# EAGLE design LCD2004_Adapter (EAGLE 9.6.2)
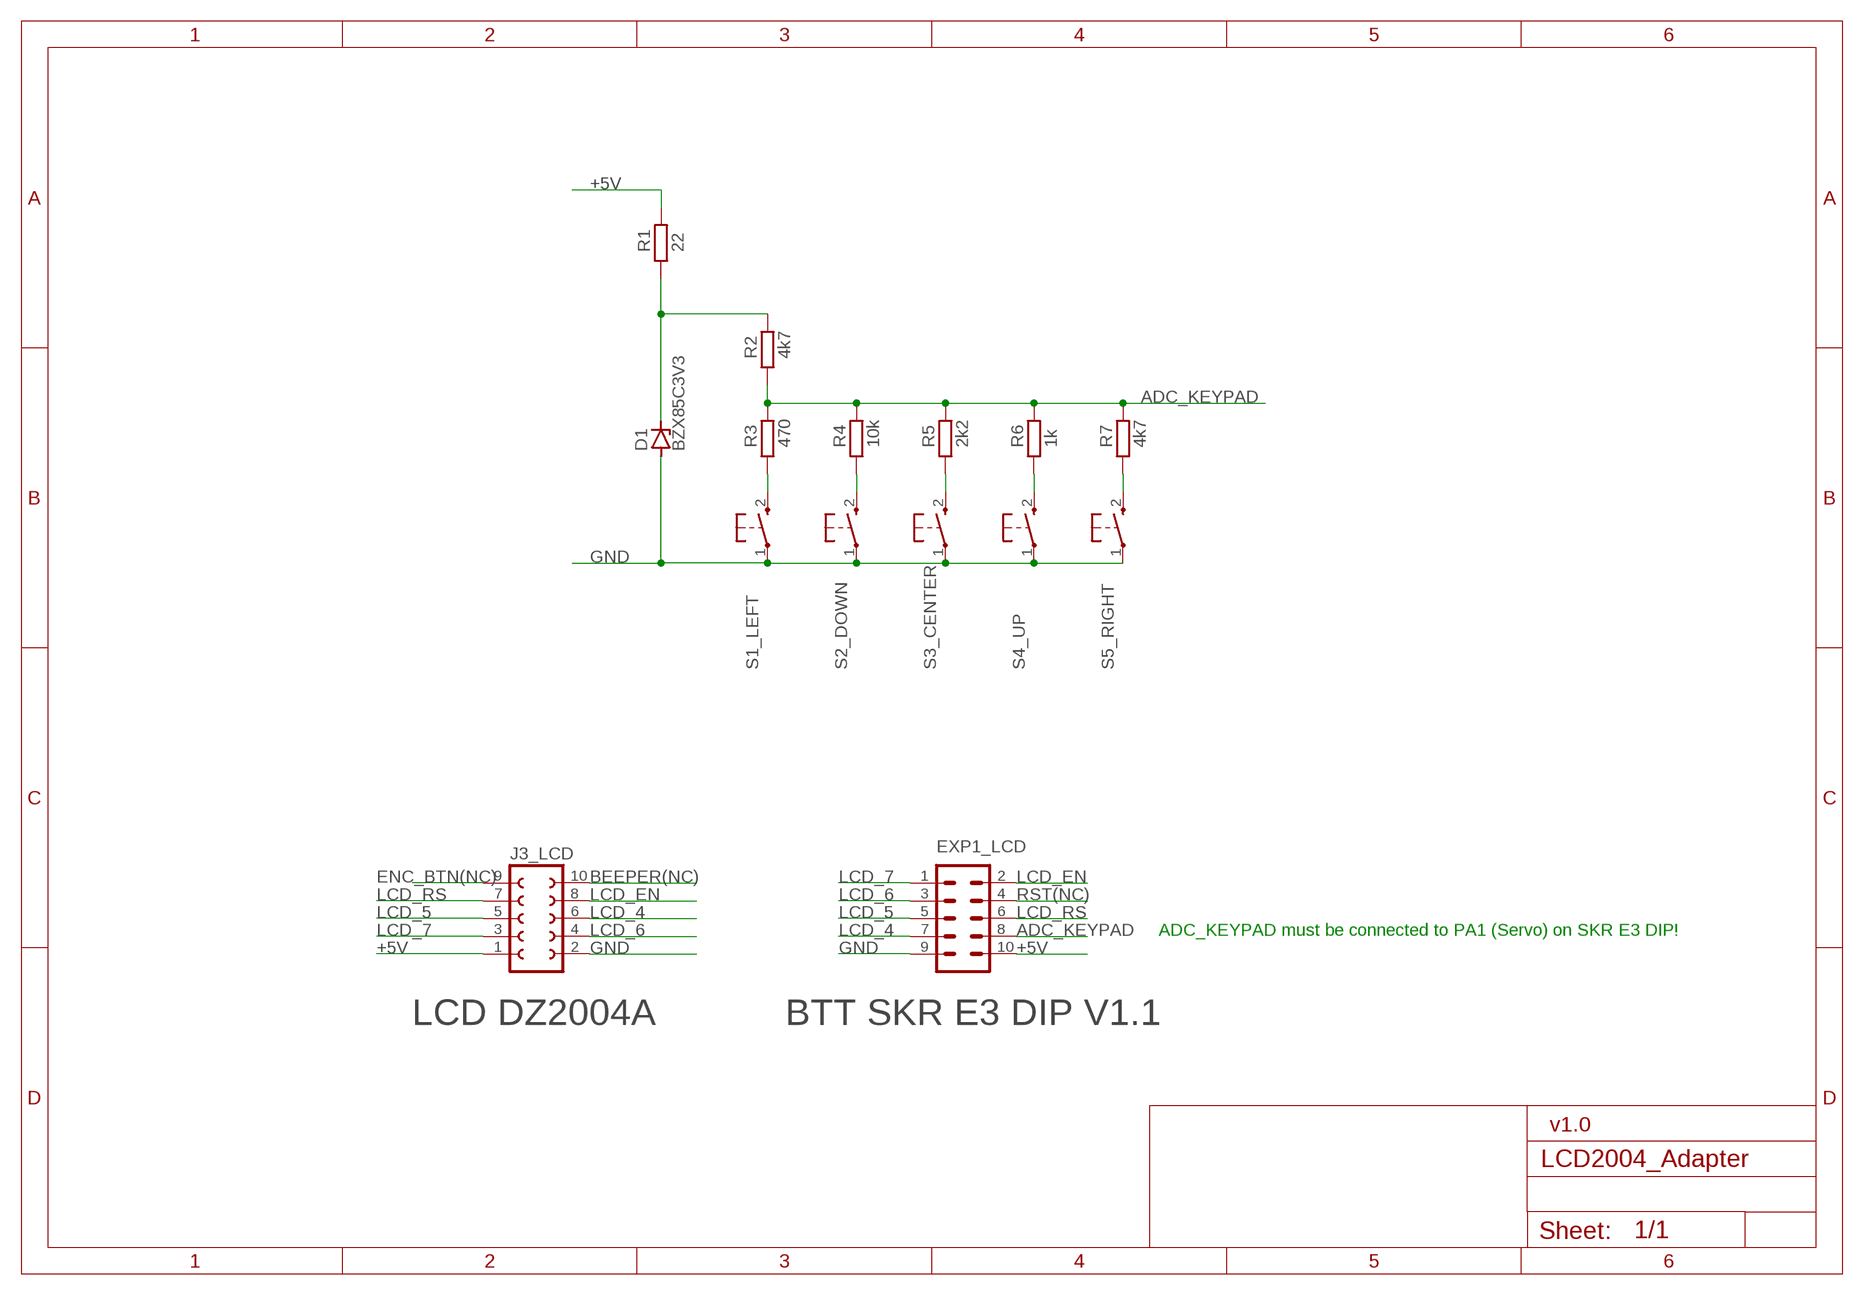
[diagram p0: schematic, sheet 1]

## Parts
D1  BZX85C3V3  BZX85  [DO41Z10]
EXP1_LCD  ML10  [ML10]
J3_LCD  FE05-2  [FE05-2]
R1  22  R-EU_0207/10  [0207/10]
R2  4k7  R-EU_0207/10  [0207/10]
R3  470  R-EU_0207/10  [0207/10]
R4  10k  R-EU_0207/10  [0207/10]
R5  2k2  R-EU_0207/10  [0207/10]
R6  1k  R-EU_0207/10  [0207/10]
R7  4k7  R-EU_0207/10  [0207/10]
S1_LEFT  KURZHUBTASTER  [B3F-10XX]
S2_DOWN  KURZHUBTASTER  [B3F-10XX]
S3_CENTER  KURZHUBTASTER  [B3F-10XX]
S4_UP  KURZHUBTASTER  [B3F-10XX]
S5_RIGHT  KURZHUBTASTER  [B3F-10XX]

## Nets
+5V: EXP1_LCD.10 J3_LCD.1 R1.2
ADC_KEYPAD: EXP1_LCD.8 R2.1 R3.2 R4.2 R5.2 R6.2 R7.2
BEEPER(NC): J3_LCD.10
ENC_BTN(NC): J3_LCD.9
GND: D1.A EXP1_LCD.9 J3_LCD.2 S1_LEFT.1(P) S2_DOWN.1(P) S3_CENTER.1(P) S4_UP.1(P) S5_RIGHT.1(P)
LCD_4: EXP1_LCD.7 J3_LCD.6
LCD_5: EXP1_LCD.5 J3_LCD.5
LCD_6: EXP1_LCD.3 J3_LCD.4
LCD_7: EXP1_LCD.1 J3_LCD.3
LCD_EN: EXP1_LCD.2 J3_LCD.8
LCD_RS: EXP1_LCD.6 J3_LCD.7
N$1: D1.C R1.1 R2.2
N$3: R3.1 S1_LEFT.2(S)
N$4: R4.1 S2_DOWN.2(S)
N$5: R5.1 S3_CENTER.2(S)
N$6: R6.1 S4_UP.2(S)
N$7: R7.1 S5_RIGHT.2(S)
RST(NC): EXP1_LCD.4

## Notes on the sheet
- ADC_KEYPAD must be connected to PA1 (Servo) on SKR E3 DIP!
- LCD DZ2004A | BTT SKR E3 DIP V1.1
- v1.0

## Library data of the parts
D1 = diode:BZX85: Z DIODE
EXP1_LCD = con-harting-ml:ML10: HARTING; OC_FARNELL: unknown; OC_NEWARK: unknown
J3_LCD = con-lsta:FE05-2: FEMALE HEADER; OC_FARNELL: unknown; OC_NEWARK: unknown
R1-R7 = rcl:R-EU_: RESISTOR, European symbol; SPICEPREFIX: R
S1_LEFT S2_DOWN S3_CENTER S4_UP S5_RIGHT = OwnDevices:KURZHUBTASTER: OMRON SWITCH

## Board
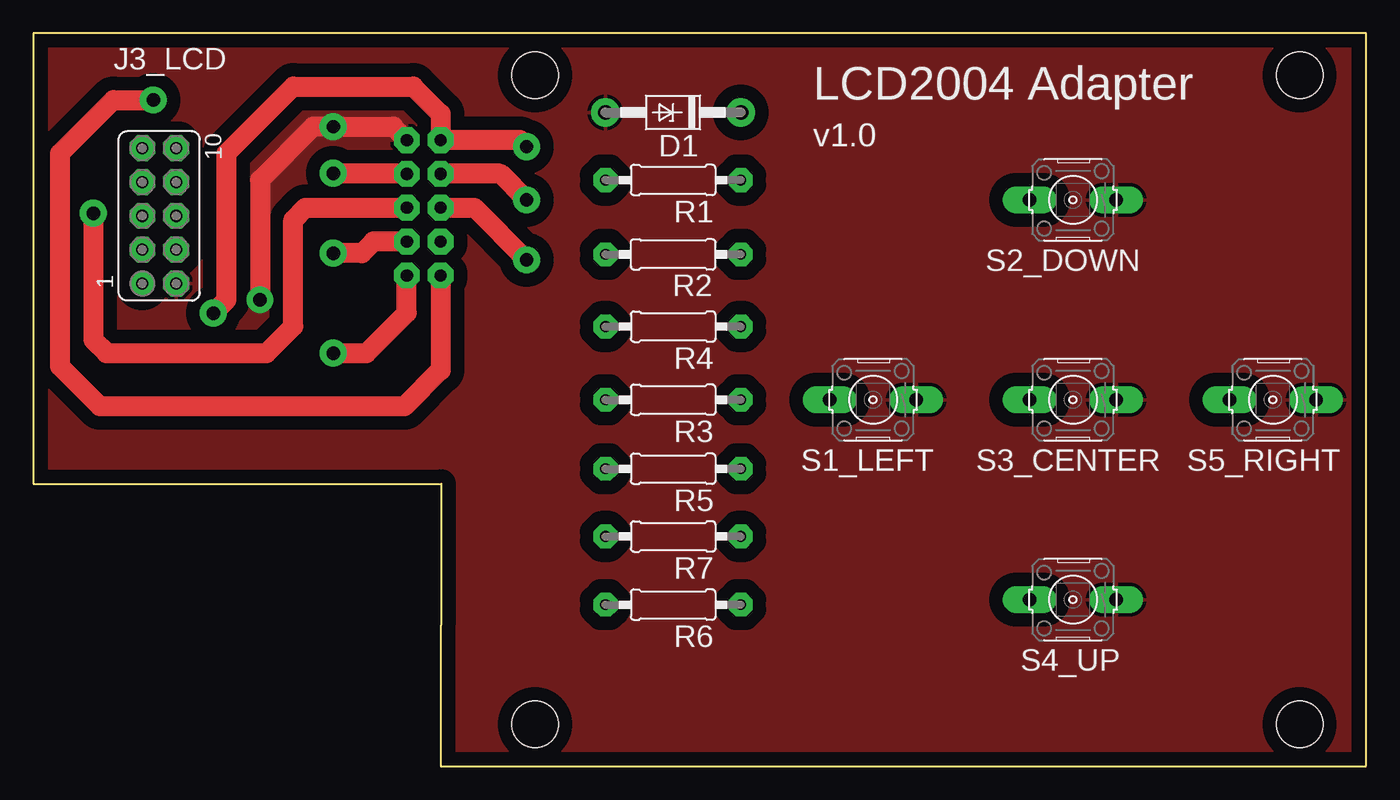
[diagram p1: board, top side]
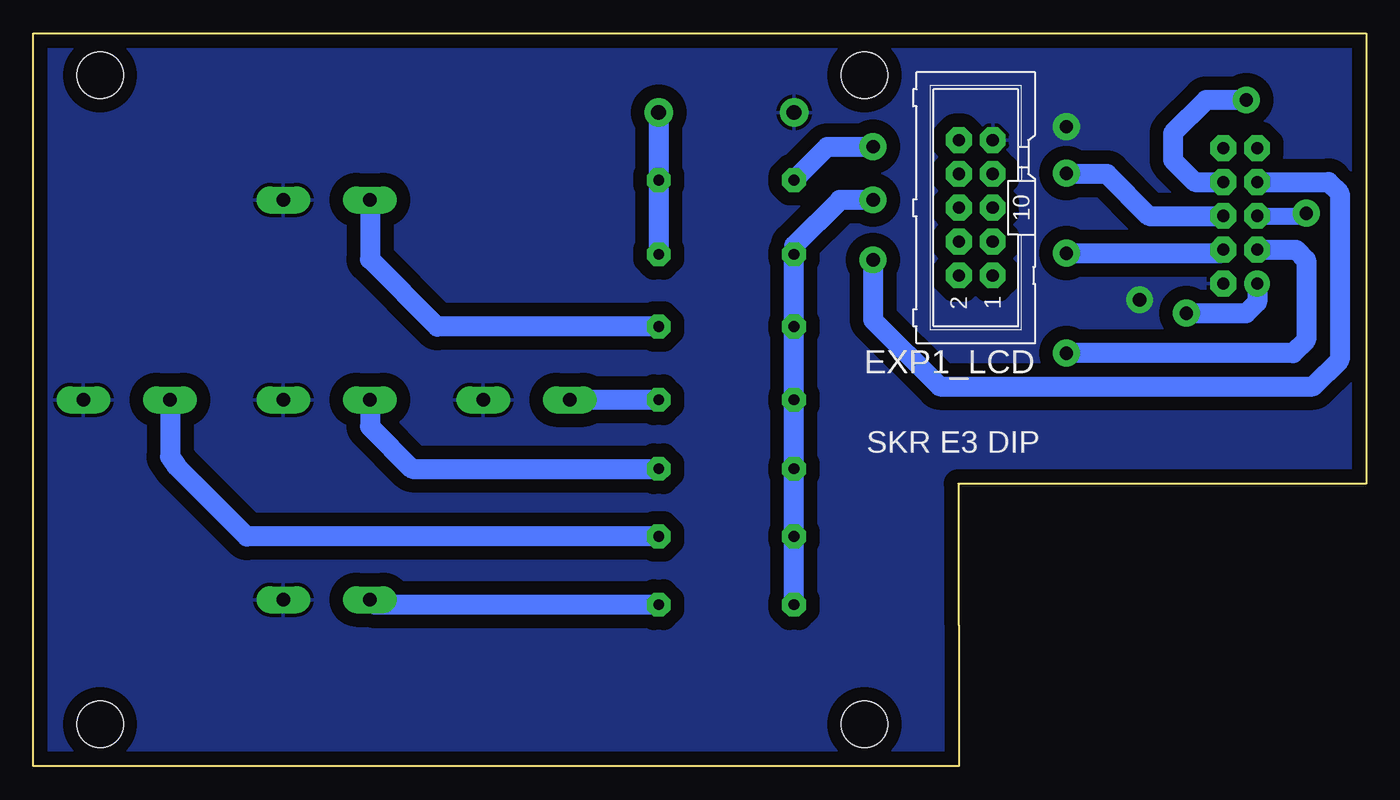
[diagram p2: board, bottom side, seen from below]

Size 100 x 55 mm. Coordinates in mm from the lower left corner, seen from the top.
Outline: 30.56,0 100,0 100,55 0,55 0,21.2 30.6,21.2 30.56,0
Copper layers (1*16): Top 0.035mm / dielectric 1.5mm / Bottom 0.035mm
Design rules "default *": minimum track width 6mil, minimum drill 0.35mm, track to track 6mil, track to pad 6mil, pad to pad 6mil, via to via 6mil, smd to smd 6mil, copper to edge 40mil, drill to drill 6mil, minimum pad ring 10mil, minimum via ring 8mil, stop-mask expansion 4mil, vias tented up to drill 0mil, thermal gap 10mil
Holes 3.5 mm at 37.65,51.85 37.65,3.15 95,3.15 95,51.85

### Footprints (pad centres in the part's own frame; a part is rotated, then mirrored left to right if it is on the bottom)
DO41Z10 = drill 1.118: A 5.08,0; C -5.08,0
ML10 = drill 0.914 octagon: 1 -5.08,-1.27; 2 -5.08,1.27; 3 -2.54,-1.27; 4 -2.54,1.27; 5 0,-1.27; 6 0,1.27; 7 2.54,-1.27; 8 2.54,1.27; 9 5.08,-1.27; 10 5.08,1.27
FE05-2 = drill 0.914: 1 -5.08,1.27 | drill 0.914 octagon: 2 -5.08,-1.27; 3 -2.54,1.27; 4 -2.54,-1.27; 5 0,1.27; 6 0,-1.27; 7 2.54,1.27; 8 2.54,-1.27; 9 5.08,1.27; 10 5.08,-1.27
0207/10 = drill 0.813 octagon: 1 -5.08,0; 2 5.08,0
B3F-10XX = drill 1.016 long: 1 -3.251,0; 2 3.251,0

### Placement (x,y rotation side)
D1  48,49.06 180 top
EXP1_LCD  29.29,41.91 90 bottom
J3_LCD  9.45,41.3 90 top
R1  48,43.99 180 top
R2  48,38.41 0 top
R3  48,27.5 180 top
R4  48,32.99 180 top
R5  48,22.32 180 top
R6  48,12.12 180 top
R7  48,17.24 180 top
S1_LEFT  63,27.5 180 top
S2_DOWN  78,42.5 180 top
S3_CENTER  78,27.5 180 top
S4_UP  78,12.5 180 top
S5_RIGHT  93,27.5 180 top

### Tracks (layer width: path | path; a pad name or v marks a point on that pad's centre or on a via)
+5V  (via drill 1)
  Top 1.27: v37,46.5 36.51,46.99
  Top 1.5: 36.51,46.99 EXP1_LCD.10 30.56,48.94 28.5,51 19.5,51 14.5,46 14.5,35 v13.5,34
  Bottom 1.5: R1.2 40.42,46.49 v37.01,46.49 v37,46.5 | J3_LCD.1 8.18,34.82 9,34 v13.5,34
ADC_KEYPAD  (via drill 1)
  Top 1.5: v37,42.5 35.05,44.45 EXP1_LCD.8
  Bottom 1.27: 42.92,39.08 R2.1
  Bottom 1.5: R6.2 R7.2 R5.2 R3.2 R4.2 R2.1 | 42.92,39.08 39.5,42.5 v37,42.5
GND  (via drill 1)
  Top 1.5: EXP1_LCD.9 27.01,48 v22.5,48 21,48 17,44 v17,35
  pour Bottom (isolate 1.016): 0,54.61 100.03,54.61 100.03,0 30.56,0 30.56,21.59 0,21.59
  pour Top (isolate 1.016): 0,55 100,55 100,0 30.5,0 30.5,21 0,21
LCD_4  (via drill 1)
  Top 1.27: 22.55,44.45 v22.5,44.5
  Top 1.5: EXP1_LCD.7 22.55,44.45
  Bottom 1.27: v22.5,44.5 22.45,44.45
  Bottom 1.5: J3_LCD.6 16.3,41.3 19.45,44.45 22.45,44.45
LCD_5  (via drill 1)
  Top 1.5: v4.5,41.5 4.5,32 5.5,31 17.5,31 19.5,33 19.5,41 20.41,41.91 EXP1_LCD.5
  Bottom 1.27: J3_LCD.5 4.7,41.3 v4.5,41.5
LCD_6  (via drill 1)
  Top 1.5: EXP1_LCD.3 25.52,39.37 24.65,38.5 v22.5,38.5
  Bottom 1.27: 10.98,38.5 J3_LCD.4
  Bottom 1.5: v22.5,38.5 10.98,38.5
LCD_7  (via drill 1)
  Top 1.5: v22.5,31 25,31 28.02,34.02 EXP1_LCD.1
  Bottom 1.5: J3_LCD.3 5.26,38.76 4.5,38 4.5,32 5.5,31 v22.5,31
LCD_EN  (via drill 1)
  Top 1.5: EXP1_LCD.2 30.56,29.72 27.84,27 5,27 2,30 2,46 6,50 v9,50
  Bottom 1.5: v9,50 12,50 14.5,47.5 14.5,45.5 12.84,43.84 J3_LCD.8
LCD_RS  (via drill 1)
  Top 1.5: EXP1_LCD.6 33.09,41.91 v37,38
  Bottom 1.5: J3_LCD.7 2.84,43.84 2,43 2,30.5 4,28.5 32,28.5 37,33.5 v37,38
N$1
  Bottom 1.27: D1.C R1.1
  Bottom 1.5: D1.C R2.2
N$3
  Bottom 1.5: R3.1 S1_LEFT.2
N$4
  Bottom 1.5: R4.1 69.7,32.99 74.75,38.04 S2_DOWN.2
N$5
  Bottom 1.5: S3_CENTER.2 74.75,25.5 71.57,22.32 R5.1
N$6
  Bottom 1.5: S4_UP.2 74.37,12.12 R6.1
N$7
  Bottom 1.5: R7.1 83.99,17.24 89.25,22.5 89.75,23.22 S5_RIGHT.2

### Text on the board
tNames: LCD2004 Adapter | v1.0
bNames: SKR E3 DIP